# Altium schematic sheet CV_Control.SchDoc
size Letter
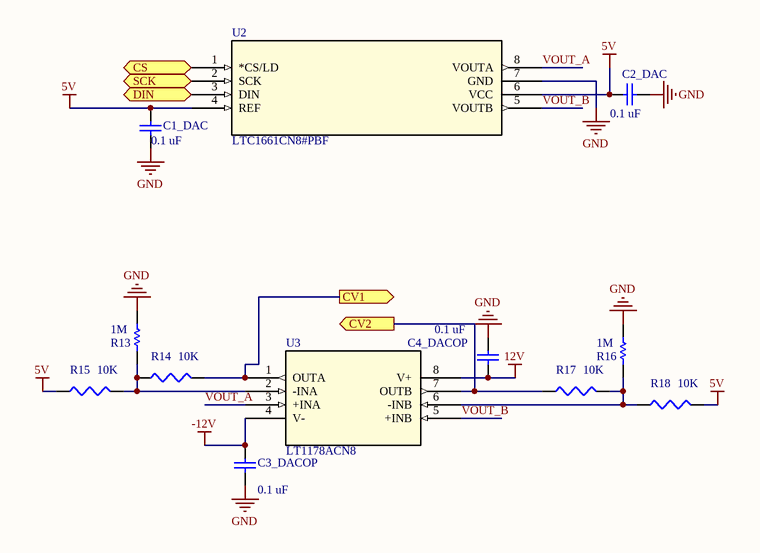
[diagram p0: CV_Control.SchDoc]

## Parts
C1_DAC  value 0.1 uF  [C0805]
C2_DAC  value 0.1 uF  [C0805]
C3_DACOP  value 0.1 uF  [C0805]
C4_DACOP  value 0.1 uF  [C0805]
R13  value 1M  [AXIAL-0.3]  (hidden comment: Res1)
R14  value 10K  [J1-0603]  (hidden comment: Res3)
R15  value 10K  [J1-0603]  (hidden comment: Res3)
R16  value 1M  [AXIAL-0.3]  (hidden comment: Res1)
R17  value 10K  [J1-0603]  (hidden comment: Res3)
R18  value 10K  [J1-0603]  (hidden comment: Res3)
U2  LTC1661CN8#PBF  [PDIP-8_N]
U3  LT1178ACN8  [PDIP-8_N]

## Ports
CS (in), CV1 (out), CV2 (out), DIN (in), SCK (in)

## Nets
5V: C1_DAC.2 C2_DAC.1 R15.1 R18.2 U2.4(REF) U2.6(VCC)
12V: C4_DACOP.1 U3.8(V+)
-12V: C3_DACOP.1 U3.4(V-)
GND: C1_DAC.1 C2_DAC.2 C3_DACOP.2 C4_DACOP.2 R13.2 R16.2 U2.7(GND)
CS: U2.1(*CS/LD) ; port CS
CV1: R14.2 U3.1(OUTA) ; port CV1
CV2: R17.1 U3.7(OUTB) ; port CV2
DIN: U2.3(DIN) ; port DIN
SCK: U2.2(SCK) ; port SCK
VOUT_A: U2.8(VOUTA) U3.3(+INA)
VOUT_B: U2.5(VOUTB) U3.5(+INB)
NetR13_1: R13.1 R14.1 R15.2 U3.2(-INA)
NetR16_1: R16.1 R17.2 R18.1 U3.6(-INB)

## Library data of the parts
C1_DAC C2_DAC C3_DACOP C4_DACOP = Cap: Capacitor; Published: 8-Jun-2000; LatestRevisionDate: 17-Jul-2002; LatestRevisionNote: Re-released for DXP Platform.; PackageReference: RAD-0.3; Publisher: Altium Limited; PackageDescription: Radial Cap, Thru-Hole; 2 Leads; 0.3 in Pin Spacing
R13 R16 = Res1: Resistor; Published: 8-Jun-2000; LatestRevisionDate: 17-Jul-2002; LatestRevisionNote: Re-released for DXP Platform.; PackageReference: AXIAL-0.3; Publisher: Altium Limited; PackageDescription: Axial Device, Thru-Hole; 2 Leads; 0.3 in Pin Spacing
R14 R15 R17 R18 = Res3: Resistor; Published: 8-Jun-2000; LatestRevisionDate: 29-May-2009; LatestRevisionNote: IPC-7351 Footprint Added.; PackageReference: J1-0603; Publisher: Altium Limited; PackageDescription: Chip Resistor
U2 = LTC1661CN8#PBF: Imported; Vendor: Linear Technology; Manufacturer_Part_Number: LTC1661CN8#PBF; Value: Value; Type: Type; RefDes: RefDes
U3 = LT1632CN8#PBF: Imported; Operating_Temperature: 0Â°C ~ 70Â°C; Current_-_Output_/_Channel: 70mA; Voltage_-_Input_Offset: 500ÂµV; Current_-_Input_Bias: 1.15ÂµA; Output_Type: Rail-to-Rail; Vendor: Linear Technology; Amplifier_Type: General Purpose; Number_of_Circuits: 2; Slew_Rate: 45 V/Âµs; Gain_Bandwidth_Product: 45MHz; Current_-_Supply: 4.6mA; Current_-_Output/Channel: 40mA; Voltage_-_Supply,_Single/Dual_(Â±): 2.7 V ~ 36 V, Â±1.35 V ~ 18 V; Mounting_Type: Through Hole; 3D_Library_Name: Maxim2; C: Copyright (C) 2016 Accelerated Designs. All rights reserved; -3db_Bandwidth: -; Series: *; Manufacturer_Part_Number: LT1632CN8#PBF; DigiKeyPartNumber: LT1632CN8-ND; Quantity_Available: 0; DataSheet: http://www.linear.com/docs/3055; Packaging: Tube; Package_/_Case: 8-DIP (0.300", 7.62mm); Copyright: Copyright (C) 2015 Accelerated Designs. All rights reserved; Supplier_Device_Package: 8-PDIP; Value: Value; Type: Type; RefDes: RefDes